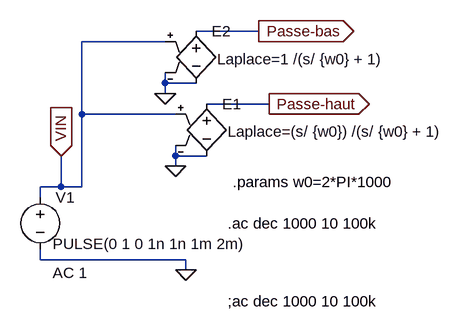
[diagram p0: schematic laplace_1rst_ordre.asc]
laplace_1rst_ordre.asc, the LTspice schematic file:
Version 4
SHEET 1 1052 692
WIRE 592 112 496 112
WIRE 448 128 320 128
WIRE 448 192 448 176
WIRE 496 192 448 192
WIRE 448 208 448 192
WIRE 608 224 512 224
WIRE 320 240 320 128
WIRE 464 240 320 240
WIRE 464 304 464 288
WIRE 512 304 464 304
WIRE 464 320 464 304
WIRE 288 352 288 304
WIRE 288 352 256 352
WIRE 320 352 320 240
WIRE 320 352 288 352
WIRE 256 368 256 352
WIRE 256 464 256 448
WIRE 480 464 256 464
WIRE 480 480 480 464
FLAG 480 480 0
FLAG 288 304 VIN
IOPIN 288 304 In
FLAG 464 320 0
FLAG 608 224 Passe-haut
IOPIN 608 224 Out
FLAG 448 208 0
FLAG 592 112 Passe-bas
IOPIN 592 112 Out
SYMBOL voltage 256 352 R0
WINDOW 3 19 88 Left 2
WINDOW 123 19 132 Left 2
WINDOW 39 0 0 Left 2
SYMATTR Value PULSE(0 1 0 1n 1n 1m 2m)
SYMATTR Value2 AC 1
SYMATTR InstName V1
SYMBOL e 512 208 R0
WINDOW 3 32 59 Left 2
SYMATTR Value Laplace=(s/ {w0}) /(s/ {w0} + 1)
SYMATTR InstName E1
SYMBOL e 496 96 R0
WINDOW 3 32 59 Left 2
SYMATTR Value Laplace=1 /(s/ {w0} + 1)
SYMATTR InstName E2
TEXT 544 528 Left 2 !;ac dec 1000 10 100k
TEXT 544 408 Left 2 !.ac dec 1000 10 100k
TEXT 552 344 Left 2 !.params w0=2*PI*1000

The netlist it stands for:
* laplace_1rst_ordre.asc
V1 VIN 0 PULSE(0 1 0 1n 1n 1m 2m) AC 1
E1 Passe-haut 0 VIN 0 Laplace=(s/ {w0}) /(s/ {w0} + 1)
E2 Passe-bas 0 VIN 0 Laplace=1 /(s/ {w0} + 1)
;ac dec 1000 10 100k
.ac dec 1000 10 100k
.params w0=2*PI*1000
.backanno
.end